# Altium schematic sheet voice_sample.schdoc
size 585 x 319 mm
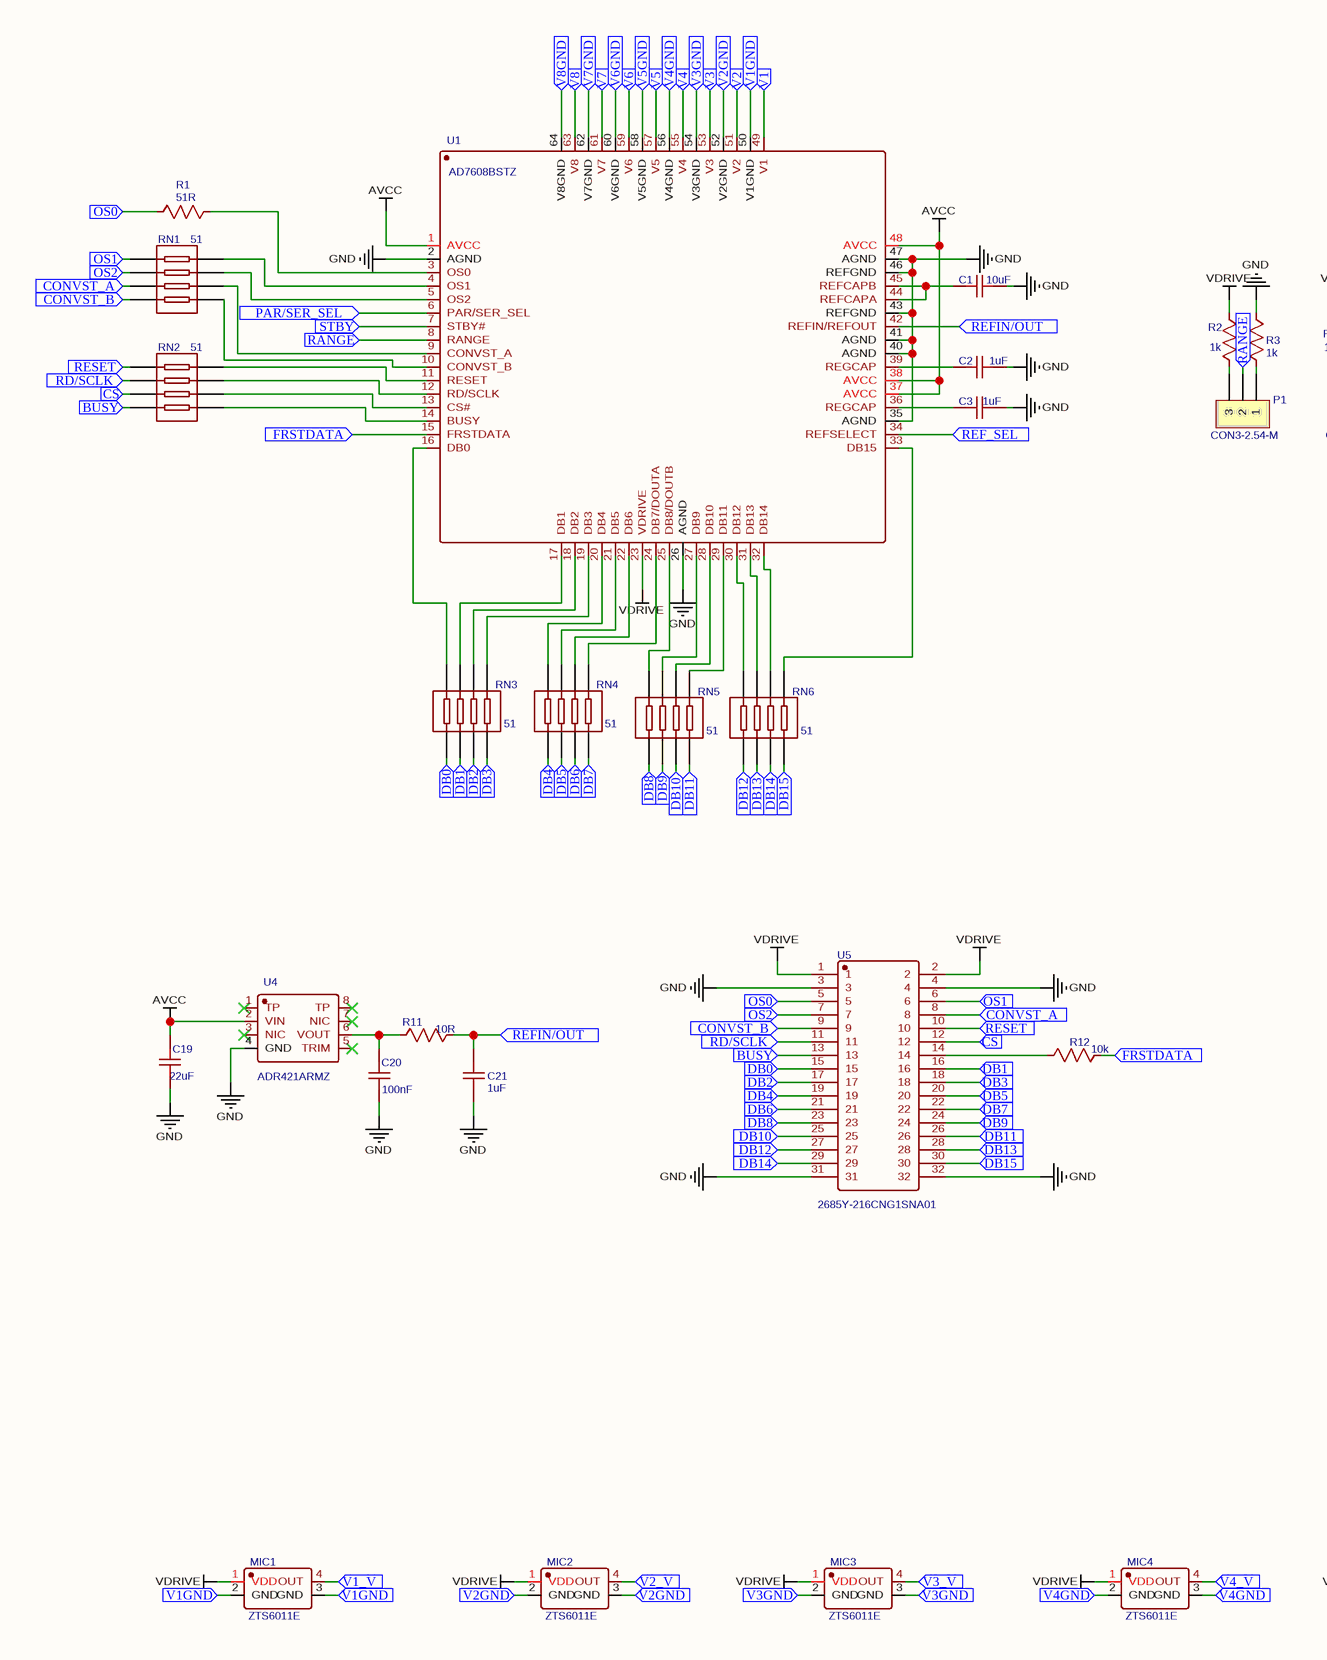
[diagram p0: voice_sample.schdoc, left]
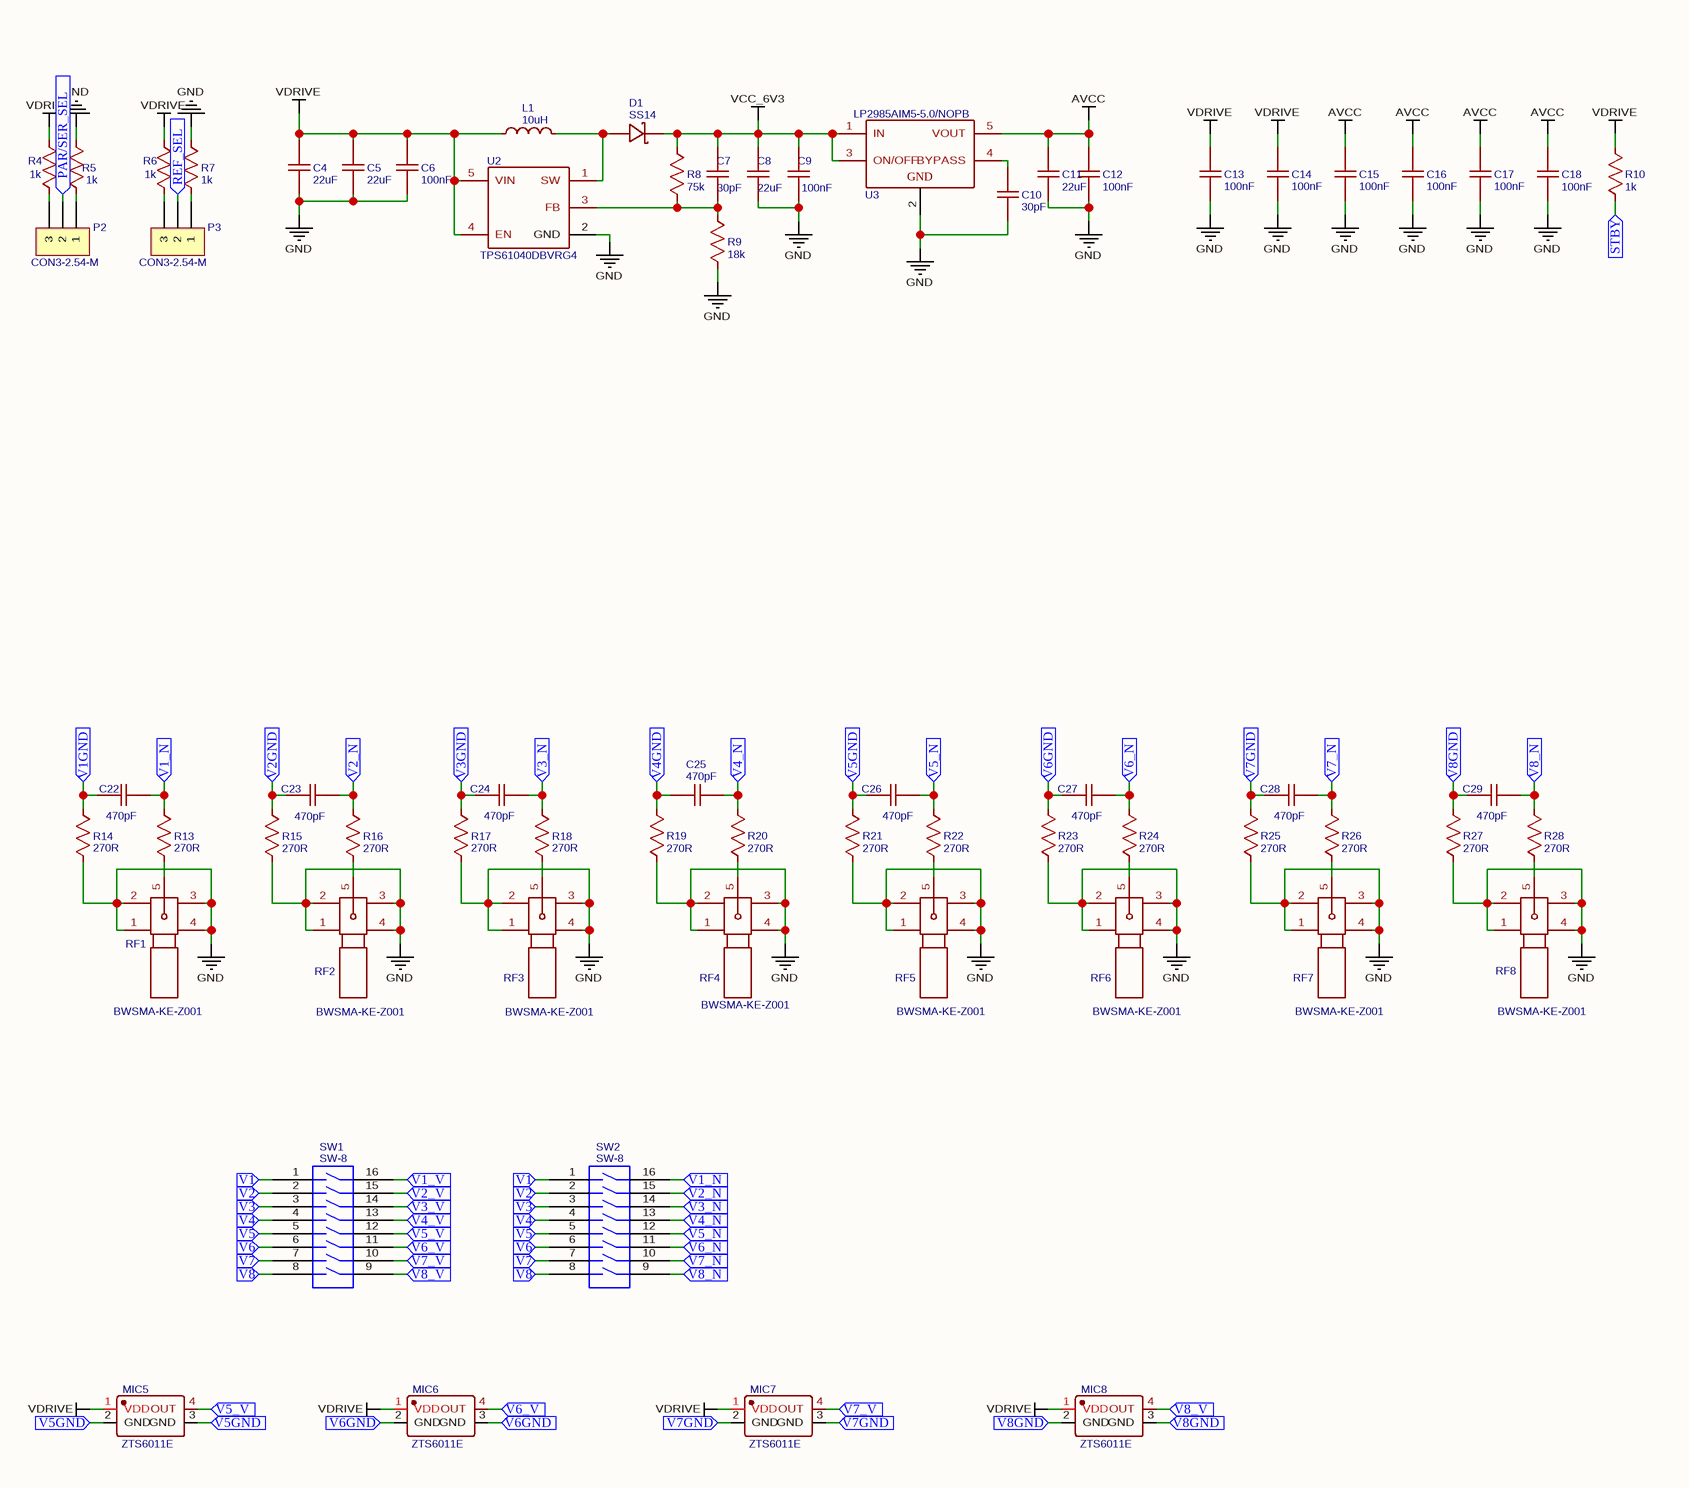
[diagram p1: voice_sample.schdoc, right]

## Parts
C1  10uF  [C0402]
C2  1uF  [C0402]
C3  1uF  [C0402]
C4  22uF  [C0402]
C5  22uF  [C0402]
C6  100nF  [C0402]
C7  30pF  [C0402]
C8  22uF  [C0402]
C9  100nF  [C0402]
C10  30pF  [C0402]
C11  22uF  [C0402]
C12  100nF  [C0402]
C13  100nF  [C0402]
C14  100nF  [C0402]
C15  100nF  [C0402]
C16  100nF  [C0402]
C17  100nF  [C0402]
C18  100nF  [C0402]
C19  22uF  [C0402]
C20  100nF  [C0402]
C21  1uF  [C0402]
C22  470pF  [C0402]
C23  470pF  [C0402]
C24  470pF  [C0402]
C25  470pF  [C0402]
C26  470pF  [C0402]
C27  470pF  [C0402]
C28  470pF  [C0402]
C29  470pF  [C0402]
D1  SS14  [SMA_L4.4-W2.8-LS5.4-RD]
L1  10uH  [L0402]
MIC1  ZTS6011E  [MIC-SMD_4P-L3.8-W3.0-P2.46-BR]
MIC2  ZTS6011E  [MIC-SMD_4P-L3.8-W3.0-P2.46-BR]
MIC3  ZTS6011E  [MIC-SMD_4P-L3.8-W3.0-P2.46-BR]
MIC4  ZTS6011E  [MIC-SMD_4P-L3.8-W3.0-P2.46-BR]
MIC5  ZTS6011E  [MIC-SMD_4P-L3.8-W3.0-P2.46-BR]
MIC6  ZTS6011E  [MIC-SMD_4P-L3.8-W3.0-P2.46-BR]
MIC7  ZTS6011E  [MIC-SMD_4P-L3.8-W3.0-P2.46-BR]
MIC8  ZTS6011E  [MIC-SMD_4P-L3.8-W3.0-P2.46-BR]
P1  CON3-2.54-M  [HDR3-2.54-M]
P2  CON3-2.54-M  [HDR3-2.54-M]
P3  CON3-2.54-M  [HDR3-2.54-M]
R1  51R  [R0402]
R2  1k  [R0402]
R3  1k  [R0402]
R4  1k  [R0402]
R5  1k  [R0402]
R6  1k  [R0402]
R7  1k  [R0402]
R8  75k  [R0402]
R9  18k  [R0402]
R10  1k  [R0402]
R11  10R  [R0402]
R12  10k  [R0402]
R13  270R  [R0402]
R14  270R  [R0402]
R15  270R  [R0402]
R16  270R  [R0402]
R17  270R  [R0402]
R18  270R  [R0402]
R19  270R  [R0402]
R20  270R  [R0402]
R21  270R  [R0402]
R22  270R  [R0402]
R23  270R  [R0402]
R24  270R  [R0402]
R25  270R  [R0402]
R26  270R  [R0402]
R27  270R  [R0402]
R28  270R  [R0402]
RF1  BWSMA-KE-Z001  [SMA-TH_BWSMA-KE-Z001]
RF2  BWSMA-KE-Z001  [SMA-TH_BWSMA-KE-Z001]
RF3  BWSMA-KE-Z001  [SMA-TH_BWSMA-KE-Z001]
RF4  BWSMA-KE-Z001  [SMA-TH_BWSMA-KE-Z001]
RF5  BWSMA-KE-Z001  [SMA-TH_BWSMA-KE-Z001]
RF6  BWSMA-KE-Z001  [SMA-TH_BWSMA-KE-Z001]
RF7  BWSMA-KE-Z001  [SMA-TH_BWSMA-KE-Z001]
RF8  BWSMA-KE-Z001  [SMA-TH_BWSMA-KE-Z001]
RN1  51  [RES-ARRAY-SMD_0402-8P-L2.0-W1.0-BL]
RN2  51  [RES-ARRAY-SMD_0402-8P-L2.0-W1.0-BL]
RN3  51  [RES-ARRAY-SMD_0402-8P-L2.0-W1.0-BL]
RN4  51  [RES-ARRAY-SMD_0402-8P-L2.0-W1.0-BL]
RN5  51  [RES-ARRAY-SMD_0402-8P-L2.0-W1.0-BL]
RN6  51  [RES-ARRAY-SMD_0402-8P-L2.0-W1.0-BL]
SW1  SW-8  [SW8]
SW2  SW-8  [SW8]
U1  AD7608BSTZ  [LQFP-64_L10.0-W10.0-P0.50-LS12.0-TL]
U2  TPS61040DBVRG4  [SOT23-5]
U3  LP2985AIM5-5.0/NOPB  [SOT-23-5_L3.0-W1.7-P0.95-LS2.8-BR]
U4  ADR421ARMZ  [MSOP-8_L3.0-W3.0-P0.65-LS4.9-BL]
U5  2685Y-216CNG1SNA01  [HDR-TH_32P-P2.54-V-F-R2-C16-S2.54]

## Ports
BUSY (in), CONVST_A (in), CONVST_B (in), CS (in), DB0 (in), DB1 (in), DB2 (in), DB3 (in), DB4 (in), DB5 (in), DB6 (in), DB7 (in), DB8 (in), DB9 (in), DB10 (in), DB11 (in), DB12 (in), DB13 (in), DB14 (in), DB15 (in), FRSTDATA (in), OS0 (in), OS1 (in), OS2 (in), PAR/SER_SEL (in), RANGE (in), RD/SCLK (in), REF_SEL (in), REFIN/OUT (in), RESET (in), STBY (in), V1 (in), V1_N (in), V1_V (in), V1GND (in), V2 (in), V2_N (in), V2_V (in), V2GND (in), V3 (in), V3_N (in), V3_V (in), V3GND (in), V4 (in), V4_N (in), V4_V (in), V4GND (in), V5 (in), V5_N (in), V5_V (in), V5GND (in), V6 (in), V6_N (in), V6_V (in), V6GND (in), V7 (in), V7_N (in), V7_V (in), V7GND (in), V8 (in), V8_N (in), V8_V (in), V8GND (in)

## Nets
AVCC: C11.2 C12.2 C15.2 C16.2 C17.2 C18.2 C19.2 U1.1(AVCC) U1.37(AVCC) U1.38(AVCC) U1.48(AVCC) U3.5(VOUT) U4.2(VIN)
GND: C1.2 C2.2 C3.2 C4.1 C5.1 C6.1 C8.1 C9.1 C10.1 C11.1 C12.1 C13.1 C14.1 C15.1 C16.1 C17.1 C18.1 C19.1 C20.1 C21.1 R3.2 R5.2 R7.2 R9.1 R14.1 R15.1 R17.1 R19.1 R21.1 R23.1 R25.1 R27.1 RF1.1 RF1.2 RF1.3 RF1.4 RF2.1 RF2.2 RF2.3 RF2.4 RF3.1 RF3.2 RF3.3 RF3.4 RF4.1 RF4.2 RF4.3 RF4.4 RF5.1 RF5.2 RF5.3 RF5.4 RF6.1 RF6.2 RF6.3 RF6.4 RF7.1 RF7.2 RF7.3 RF7.4 RF8.1 RF8.2 RF8.3 RF8.4 U1.2(AGND) U1.26(AGND) U1.35(AGND) U1.40(AGND) U1.41(AGND) U1.43(REFGND) U1.46(REFGND) U1.47(AGND) U2.2(GND) U3.2(GND) U4.4(GND) U5.3 U5.4 U5.31 U5.32
VCC_6V3: C7.2 C8.2 C9.2 D1.1(K) R8.2 U3.1(IN) U3.3(ON/OFF)
VDRIVE: C4.2 C5.2 C6.2 C13.2 C14.2 L1.1 MIC1.1(VDD) MIC2.1(VDD) MIC3.1(VDD) MIC4.1(VDD) MIC5.1(VDD) MIC6.1(VDD) MIC7.1(VDD) MIC8.1(VDD) R2.2 R4.2 R6.2 R10.2 U1.23(VDRIVE) U2.4(EN) U2.5(VIN) U5.1 U5.2
BUSY: RN2.8 U5.13 ; port BUSY
CONVST_A: RN1.7 U5.8 ; port CONVST_A
CONVST_B: RN1.8 U5.9 ; port CONVST_B
CS: RN2.7 U5.12 ; port CS
DB0: RN3.1 U5.15 ; port DB0
DB1: RN3.2 U5.16 ; port DB1
DB2: RN3.3 U5.17 ; port DB2
DB3: RN3.4 U5.18 ; port DB3
DB4: RN4.1 U5.19 ; port DB4
DB5: RN4.2 U5.20 ; port DB5
DB6: RN4.3 U5.21 ; port DB6
DB7: RN4.4 U5.22 ; port DB7
DB8: RN5.1 U5.23 ; port DB8
DB9: RN5.2 U5.24 ; port DB9
DB10: RN5.3 U5.25 ; port DB10
DB11: RN5.4 U5.26 ; port DB11
DB12: RN6.1 U5.27 ; port DB12
DB13: RN6.2 U5.28 ; port DB13
DB14: RN6.3 U5.29 ; port DB14
DB15: RN6.4 U5.30 ; port DB15
FRSTDATA: R12.2 U1.15(FRSTDATA) ; port FRSTDATA
OS0: R1.1 U5.5 ; port OS0
OS1: RN1.5 U5.6 ; port OS1
OS2: RN1.6 U5.7 ; port OS2
PAR/SER_SEL: P2.2 U1.6(PAR/SER_SEL) ; port PAR/SER_SEL
RANGE: P1.2 U1.8(RANGE) ; port RANGE
RD/SCLK: RN2.6 U5.11 ; port RD/SCLK
REF_SEL: P3.2 U1.34(REFSELECT) ; port REF_SEL
REFIN/OUT: C21.2 R11.2 U1.42(REFIN/REFOUT) ; port REFIN/OUT
RESET: RN2.5 U5.10 ; port RESET
STBY: R10.1 U1.7(STBY#) ; port STBY
V1: SW1.1 SW2.1 U1.49(V1) ; port V1
V1_N: C22.2 R13.2 SW2.16 ; port V1_N
V1_V: MIC1.4(OUT) SW1.16 ; port V1_V
V1GND: C22.1 MIC1.2(GND) MIC1.3(GND) R14.2 U1.50(V1GND) ; port V1GND
V2: SW1.2 SW2.2 U1.51(V2) ; port V2
V2_N: C23.2 R16.2 SW2.15 ; port V2_N
V2_V: MIC2.4(OUT) SW1.15 ; port V2_V
V2GND: C23.1 MIC2.2(GND) MIC2.3(GND) R15.2 U1.52(V2GND) ; port V2GND
V3: SW1.3 SW2.3 U1.53(V3) ; port V3
V3_N: C24.2 R18.2 SW2.14 ; port V3_N
V3_V: MIC3.4(OUT) SW1.14 ; port V3_V
V3GND: C24.1 MIC3.2(GND) MIC3.3(GND) R17.2 U1.54(V3GND) ; port V3GND
V4: SW1.4 SW2.4 U1.55(V4) ; port V4
V4_N: C25.1 R20.2 SW2.13 ; port V4_N
V4_V: MIC4.4(OUT) SW1.13 ; port V4_V
V4GND: C25.2 MIC4.2(GND) MIC4.3(GND) R19.2 U1.56(V4GND) ; port V4GND
V5: SW1.5 SW2.5 U1.57(V5) ; port V5
V5_N: C26.2 R22.2 SW2.12 ; port V5_N
V5_V: MIC5.4(OUT) SW1.12 ; port V5_V
V5GND: C26.1 MIC5.2(GND) MIC5.3(GND) R21.2 U1.58(V5GND) ; port V5GND
V6: SW1.6 SW2.6 U1.59(V6) ; port V6
V6_N: C27.2 R24.2 SW2.11 ; port V6_N
V6_V: MIC6.4(OUT) SW1.11 ; port V6_V
V6GND: C27.1 MIC6.2(GND) MIC6.3(GND) R23.2 U1.60(V6GND) ; port V6GND
V7: SW1.7 SW2.7 U1.61(V7) ; port V7
V7_N: C28.2 R26.2 SW2.10 ; port V7_N
V7_V: MIC7.4(OUT) SW1.10 ; port V7_V
V7GND: C28.1 MIC7.2(GND) MIC7.3(GND) R25.2 U1.62(V7GND) ; port V7GND
V8: SW1.8 SW2.8 U1.63(V8) ; port V8
V8_N: C29.2 R28.2 SW2.9 ; port V8_N
V8_V: MIC8.4(OUT) SW1.9 ; port V8_V
V8GND: C29.1 MIC8.2(GND) MIC8.3(GND) R27.2 U1.64(V8GND) ; port V8GND
NetC1_1: C1.1 U1.44(REFCAPA) U1.45(REFCAPB)
NetC2_1: C2.1 U1.39(REGCAP)
NetC3_1: C3.1 U1.36(REGCAP)
NetC7_1: C7.1 R8.1 R9.2 U2.3(FB)
NetC10_2: C10.2 U3.4(BYPASS)
NetC20_2: C20.2 R11.1 U4.6(VOUT)
NetD1_2: D1.2(A) L1.2 U2.1(SW)
NetP1_1: P1.1 R3.1
NetP1_3: P1.3 R2.1
NetP2_1: P2.1 R5.1
NetP2_3: P2.3 R4.1
NetP3_1: P3.1 R7.1
NetP3_3: P3.3 R6.1
NetR1_2: R1.2 U1.3(OS0)
NetR12_1: R12.1 U5.14
NetR13_1: R13.1 RF1.5
NetR16_1: R16.1 RF2.5
NetR18_1: R18.1 RF3.5
NetR20_1: R20.1 RF4.5
NetR22_1: R22.1 RF5.5
NetR24_1: R24.1 RF6.5
NetR26_1: R26.1 RF7.5
NetR28_1: R28.1 RF8.5
NetRN1_1: RN1.1 U1.10(CONVST_B)
NetRN1_2: RN1.2 U1.9(CONVST_A)
NetRN1_3: RN1.3 U1.5(OS2)
NetRN1_4: RN1.4 U1.4(OS1)
NetRN2_1: RN2.1 U1.14(BUSY)
NetRN2_2: RN2.2 U1.13(CS#)
NetRN2_3: RN2.3 U1.12(RD/SCLK)
NetRN2_4: RN2.4 U1.11(RESET)
NetRN3_5: RN3.5 U1.19(DB3)
NetRN3_6: RN3.6 U1.18(DB2)
NetRN3_7: RN3.7 U1.17(DB1)
NetRN3_8: RN3.8 U1.16(DB0)
NetRN4_5: RN4.5 U1.24(DB7/DOUTA)
NetRN4_6: RN4.6 U1.22(DB6)
NetRN4_7: RN4.7 U1.21(DB5)
NetRN4_8: RN4.8 U1.20(DB4)
NetRN5_5: RN5.5 U1.29(DB11)
NetRN5_6: RN5.6 U1.28(DB10)
NetRN5_7: RN5.7 U1.27(DB9)
NetRN5_8: RN5.8 U1.25(DB8/DOUTB)
NetRN6_5: RN6.5 U1.33(DB15)
NetRN6_6: RN6.6 U1.32(DB14)
NetRN6_7: RN6.7 U1.31(DB13)
NetRN6_8: RN6.8 U1.30(DB12)

Not connected (* = marked no-connect by the designer): U4 1(TP)* 3(NIC)* 5(TRIM)* 7(NIC)* 8(TP)*

## Library data of the parts
C1 = 10uF: nameAlias: Value(F); Contributor: LCEDA_Lib; spicePre: C; spiceSymbolName: C_0402_US
C2 C3 C21 = 1uF: nameAlias: Value(F); Contributor: LCEDA_Lib; spicePre: C; spiceSymbolName: C_0402_US
C4 C5 C8 C11 C19 = 22uF: nameAlias: Value(F); Contributor: LCEDA_Lib; spicePre: C; spiceSymbolName: C_0402_US
C6 C9 C12-C18 C20 = 100nF: nameAlias: Value(F); Contributor: LCEDA_Lib; spicePre: C; spiceSymbolName: C_0402_US
C7 C10 = 30pF: nameAlias: Value(F); Contributor: LCEDA_Lib; spicePre: C; spiceSymbolName: C_0402_US
C22-C29 = 470pF: nameAlias: Value(F); Contributor: LCEDA_Lib; spicePre: C; spiceSymbolName: C_0402_US
D1 = SS14: BOM_Manufacturer: MDD; BOM_Supplier: LCSC; BOM_Manufacturer Part: SS14; BOM_Supplier Part: C2480; BOM_JLCPCB Part Class: Basic Part; spicePre: D; spiceSymbolName: SS14
L1 = 10uH: nameAlias: Value(H); Contributor: LCEDA_Lib; spicePre: L; spiceSymbolName: L0402_US
MIC1-MIC8 = ZTS6011E: BOM_Manufacturer: ZILLTEK; Contributor: LCSC; BOM_Supplier: LCSC; BOM_Supplier Part: C481291; BOM_Manufacturer Part: ZTS6011E; BOM_JLCPCB Part Class: Extended Part; spicePre: M; spiceSymbolName: ZTS6011E
P1-P3 = CON3-2.54-M: Contributor: tstest01; spicePre: P; spiceSymbolName: CON3-2.54-M
R1 = 51R: nameAlias: Value(Ω); Contributor: LCEDA_Lib; spicePre: R; spiceSymbolName: R_0402_US
R2-R7 R10 = 1k: nameAlias: Value(Ω); Contributor: LCEDA_Lib; spicePre: R; spiceSymbolName: R_0402_US
R8 = 75k: nameAlias: Value(Ω); Contributor: LCEDA_Lib; spicePre: R; spiceSymbolName: R_0402_US
R9 = 18k: nameAlias: Value(Ω); Contributor: LCEDA_Lib; spicePre: R; spiceSymbolName: R_0402_US
R11 = 10R: nameAlias: Value(Ω); Contributor: LCEDA_Lib; spicePre: R; spiceSymbolName: R_0402_US
R12 = 10k: nameAlias: Value(Ω); Contributor: LCEDA_Lib; spicePre: R; spiceSymbolName: R_0402_US
R13-R28 = 270R: nameAlias: Value(Ω); Contributor: LCEDA_Lib; spicePre: R; spiceSymbolName: R_0402_US
RF1-RF8 = BWSMA-KE-Z001: BOM_Manufacturer: BAT WIRELESS; Contributor: LCSC; BOM_Supplier: LCSC; BOM_Supplier Part: C496549; BOM_Manufacturer Part: BWSMA-KE-Z001; BOM_JLCPCB Part Class: Extended Part; spicePre: R; spiceSymbolName: BWSMA-KE-Z001
RN1-RN6 = 51: BOM_Manufacturer: RALEC; BOM_Manufacturer Part: RTA02-4D510JTH; nameAlias: Resistance (Ohms); BOM_Supplier: LCSC; BOM_Supplier Part: C102639; BOM_JLCPCB Part Class: Extended Part; spicePre: R; spiceSymbolName: RTA02-4D510JTH
SW1 SW2 = SW-8: Contributor: taifa1122; spicePre: S; spiceSymbolName: SW-8
U1 = AD7608BSTZ: BOM_Manufacturer: Analog Devices; Contributor: LCSC; BOM_Supplier: LCSC; BOM_Supplier Part: C128619; BOM_Manufacturer Part: AD7608BSTZ; BOM_JLCPCB Part Class: Extended Part; spicePre: U; spiceSymbolName: AD7608BSTZ
U2 = TPS61040DBVRG4: description: 28 V, 400 mA Switch Boost Converter for White LED Applications, 1.8 to 6 V, -40 to 85 degC, 5-pin SOT23 (DBV5), Green (RoHS  no SbBr); spicePre: U; spiceSymbolName: TPS61040DBVRG4
U3 = LP2985AIM5-5.0/NOPB: BOM_Manufacturer: TI; Contributor: LCSC; BOM_Supplier: LCSC; BOM_Manufacturer Part: LP2985AIM5-5.0/NOPB; BOM_Supplier Part: C130188; BOM_JLCPCB Part Class: Extended Part; spicePre: U; spiceSymbolName: LP2985AIM5-5.0/NOPB
U4 = ADR421ARMZ: BOM_Manufacturer: Analog Devices; Contributor: LCSC; BOM_Supplier: LCSC; BOM_Supplier Part: C659530; BOM_Manufacturer Part: ADR421ARMZ; BOM_JLCPCB Part Class: Extended Part; spicePre: U; spiceSymbolName: ADR421ARMZ
U5 = 2685Y-216CNG1SNA01: BOM_Manufacturer: 华宇创; Contributor: LCSC; BOM_Supplier: LCSC; BOM_Supplier Part: C350290; BOM_Manufacturer Part: 2685Y-216CNG1SNA01; BOM_JLCPCB Part Class: Extended Part; spicePre: U; spiceSymbolName: 2685Y-216CNG1SNA01